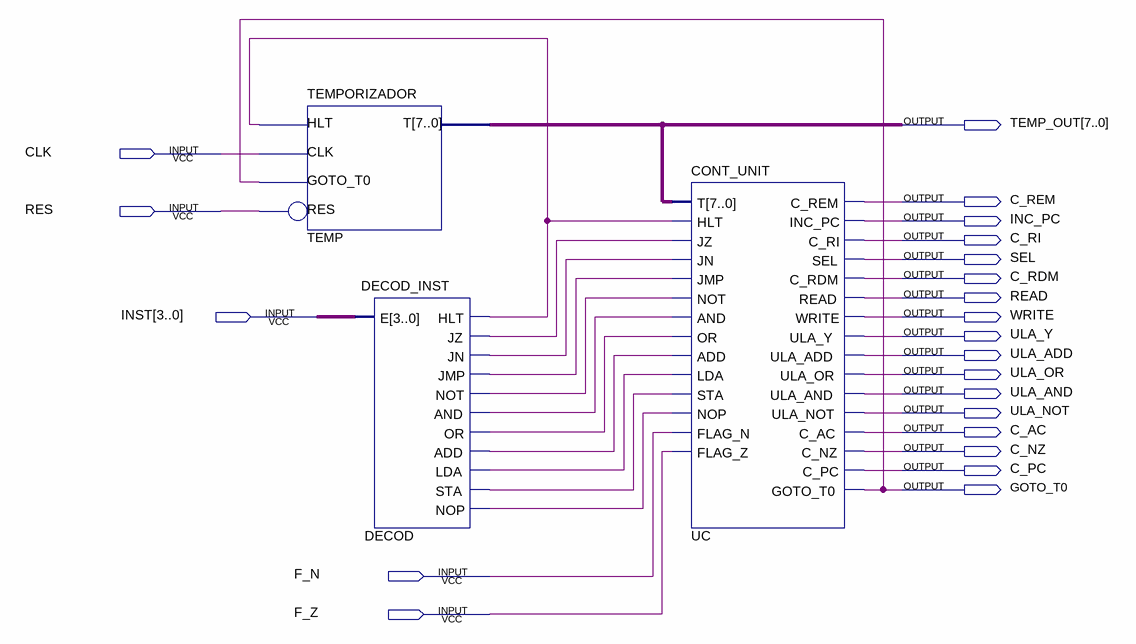
[diagram p0: schematic sheet]
// Quartus schematic UNID_CONT.bdf as structural Verilog: 3 symbols, 22 pins
module UNID_CONT (
  input  CLK,
  input  RES,
  input  [3:0] INST,
  input  F_N,
  input  F_Z,
  output [7:0] TEMP_OUT,
  output C_REM,
  output INC_PC,
  output C_RI,
  output SEL,
  output C_RDM,
  output READ,
  output WRITE,
  output ULA_Y,
  output ULA_ADD,
  output ULA_OR,
  output ULA_AND,
  output ULA_NOT,
  output C_AC,
  output C_NZ,
  output C_PC,
  output GOTO_T0
);

  wire DECOD_add, DECOD_and, DECOD_hlt, DECOD_jmp, DECOD_jn, DECOD_jz, DECOD_lda, DECOD_nop, DECOD_not,
       DECOD_or, DECOD_sta;

  TEMPORIZADOR TEMP (.HLT(DECOD_hlt), .CLK(CLK), .GOTO_T0(GOTO_T0), .RES(RES), .T(TEMP_OUT));
  DECOD_INST DECOD (
    .E(INST), .HLT(DECOD_hlt), .JZ(DECOD_jz), .JN(DECOD_jn), .JMP(DECOD_jmp), .NOT(DECOD_not),
    .AND(DECOD_and), .OR(DECOD_or), .ADD(DECOD_add), .LDA(DECOD_lda), .STA(DECOD_sta), .NOP(DECOD_nop));
  CONT_UNIT UC (
    .T(TEMP_OUT), .HLT(DECOD_hlt), .JZ(DECOD_jz), .JN(DECOD_jn), .JMP(DECOD_jmp), .NOT(DECOD_not),
    .AND(DECOD_and), .OR(DECOD_or), .ADD(DECOD_add), .LDA(DECOD_lda), .STA(DECOD_sta), .NOP(DECOD_nop),
    .FLAG_N(F_N), .FLAG_Z(F_Z), .C_REM(C_REM), .INC_PC(INC_PC), .C_RI(C_RI), .SEL(SEL), .C_RDM(C_RDM),
    .READ(READ), .WRITE(WRITE), .ULA_Y(ULA_Y), .ULA_OR(ULA_OR), .ULA_NOT(ULA_NOT), .ULA_AND(ULA_AND),
    .C_AC(C_AC), .C_NZ(C_NZ), .C_PC(C_PC), .GOTO_T0(GOTO_T0), .ULA_ADD(ULA_ADD));
endmodule
